# Altium schematic sheet DAC_0.SchDoc
size A2; Date: Date; CompanyName: HESSO; Engineer: Name; Address1: Route du Rawyl 47; Address2: 1950 Sion; Address3: Switzerland; DocumentNumber: 6; SheetNumber: 6; SheetTotal: 6; ProjectName: Project Name
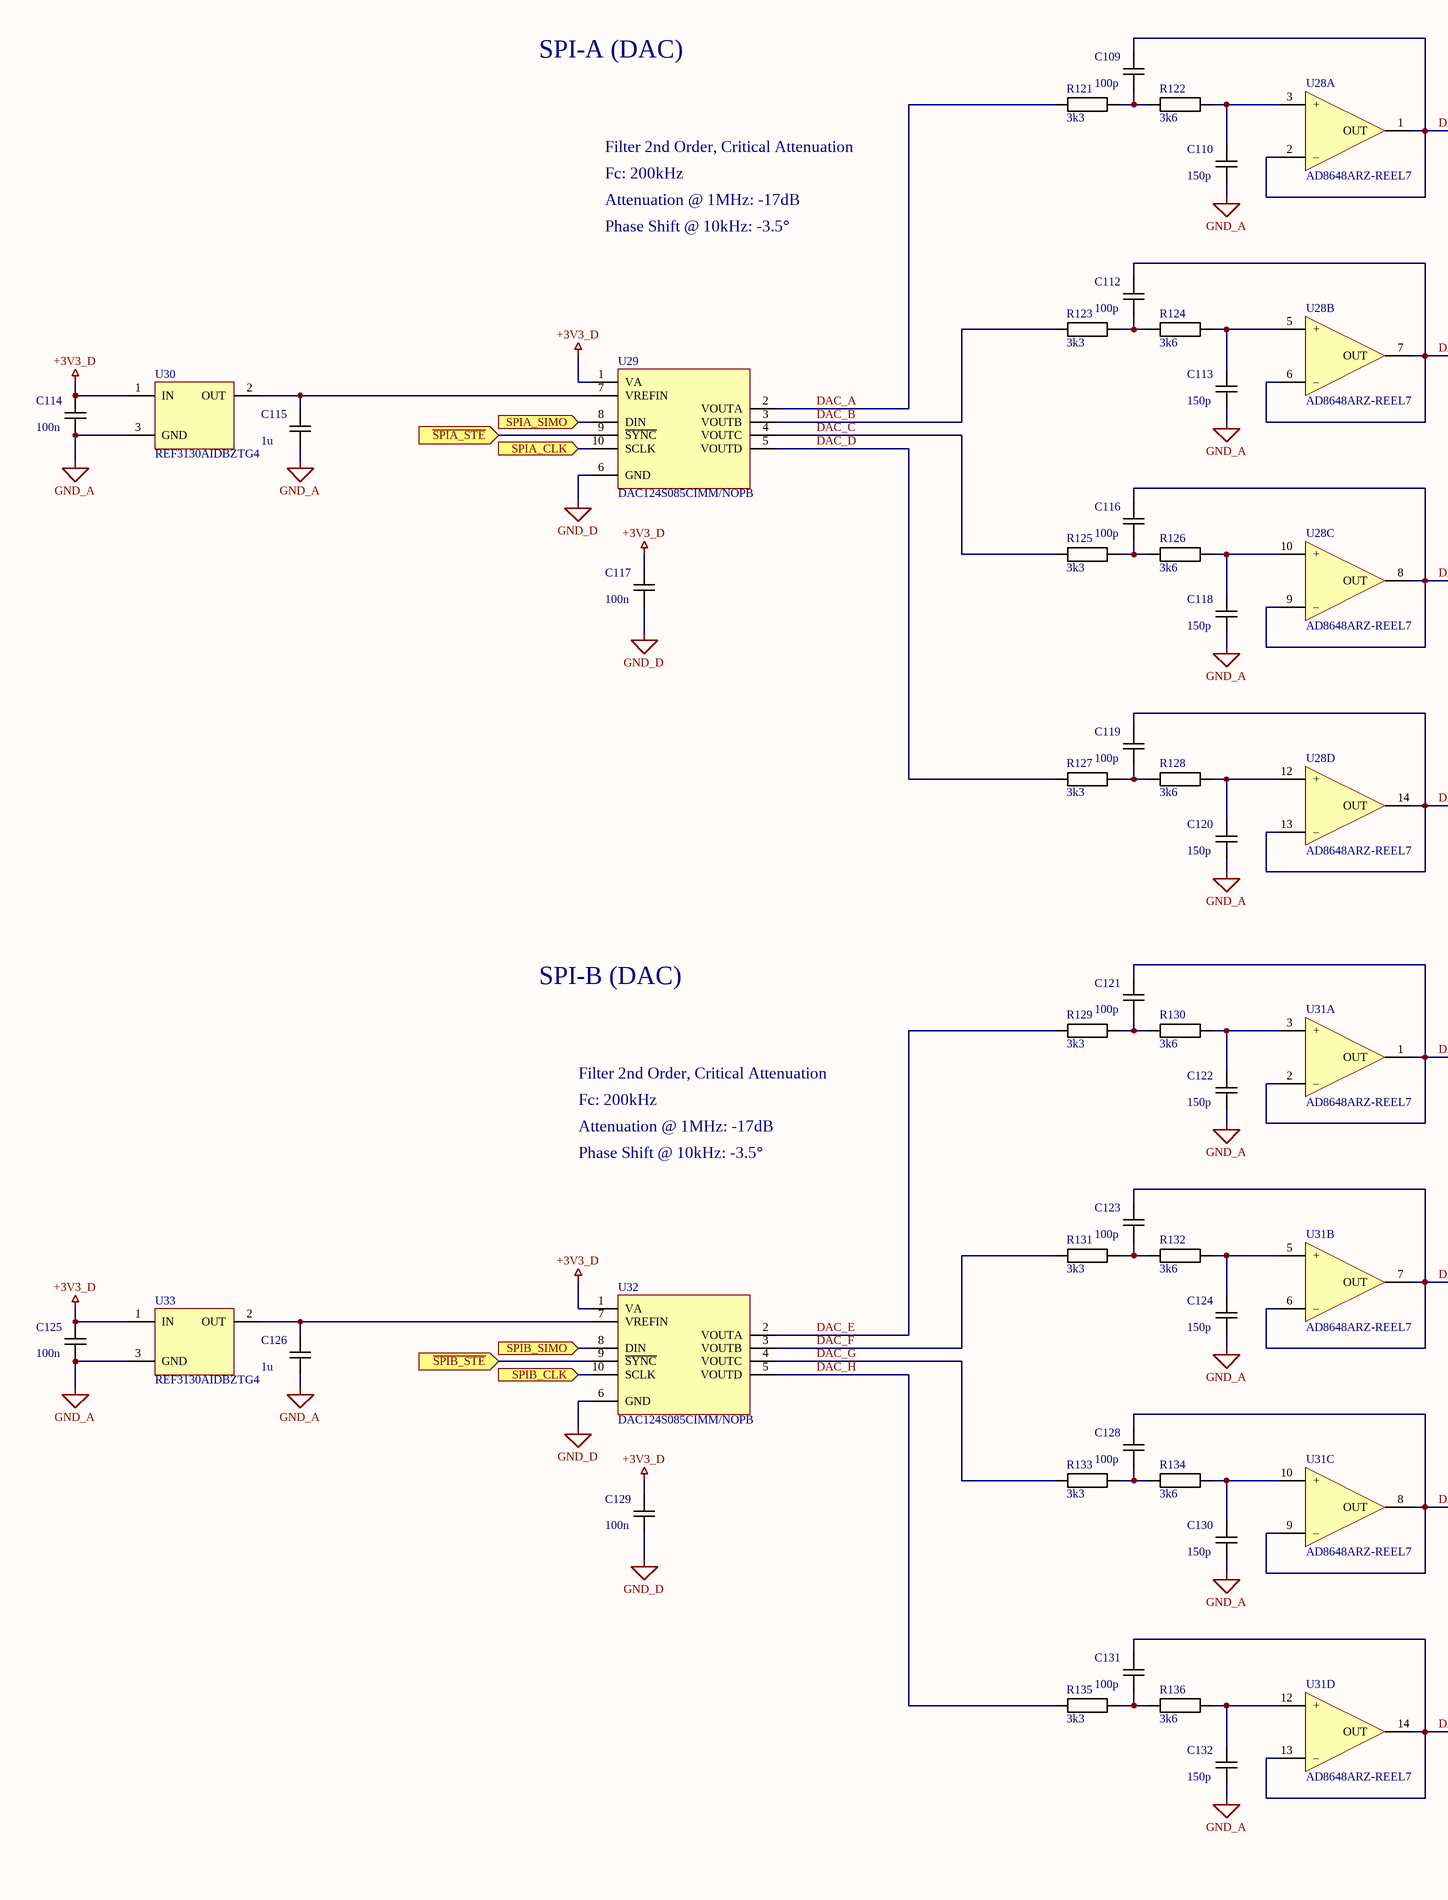
[diagram p0: DAC_0.SchDoc, left]
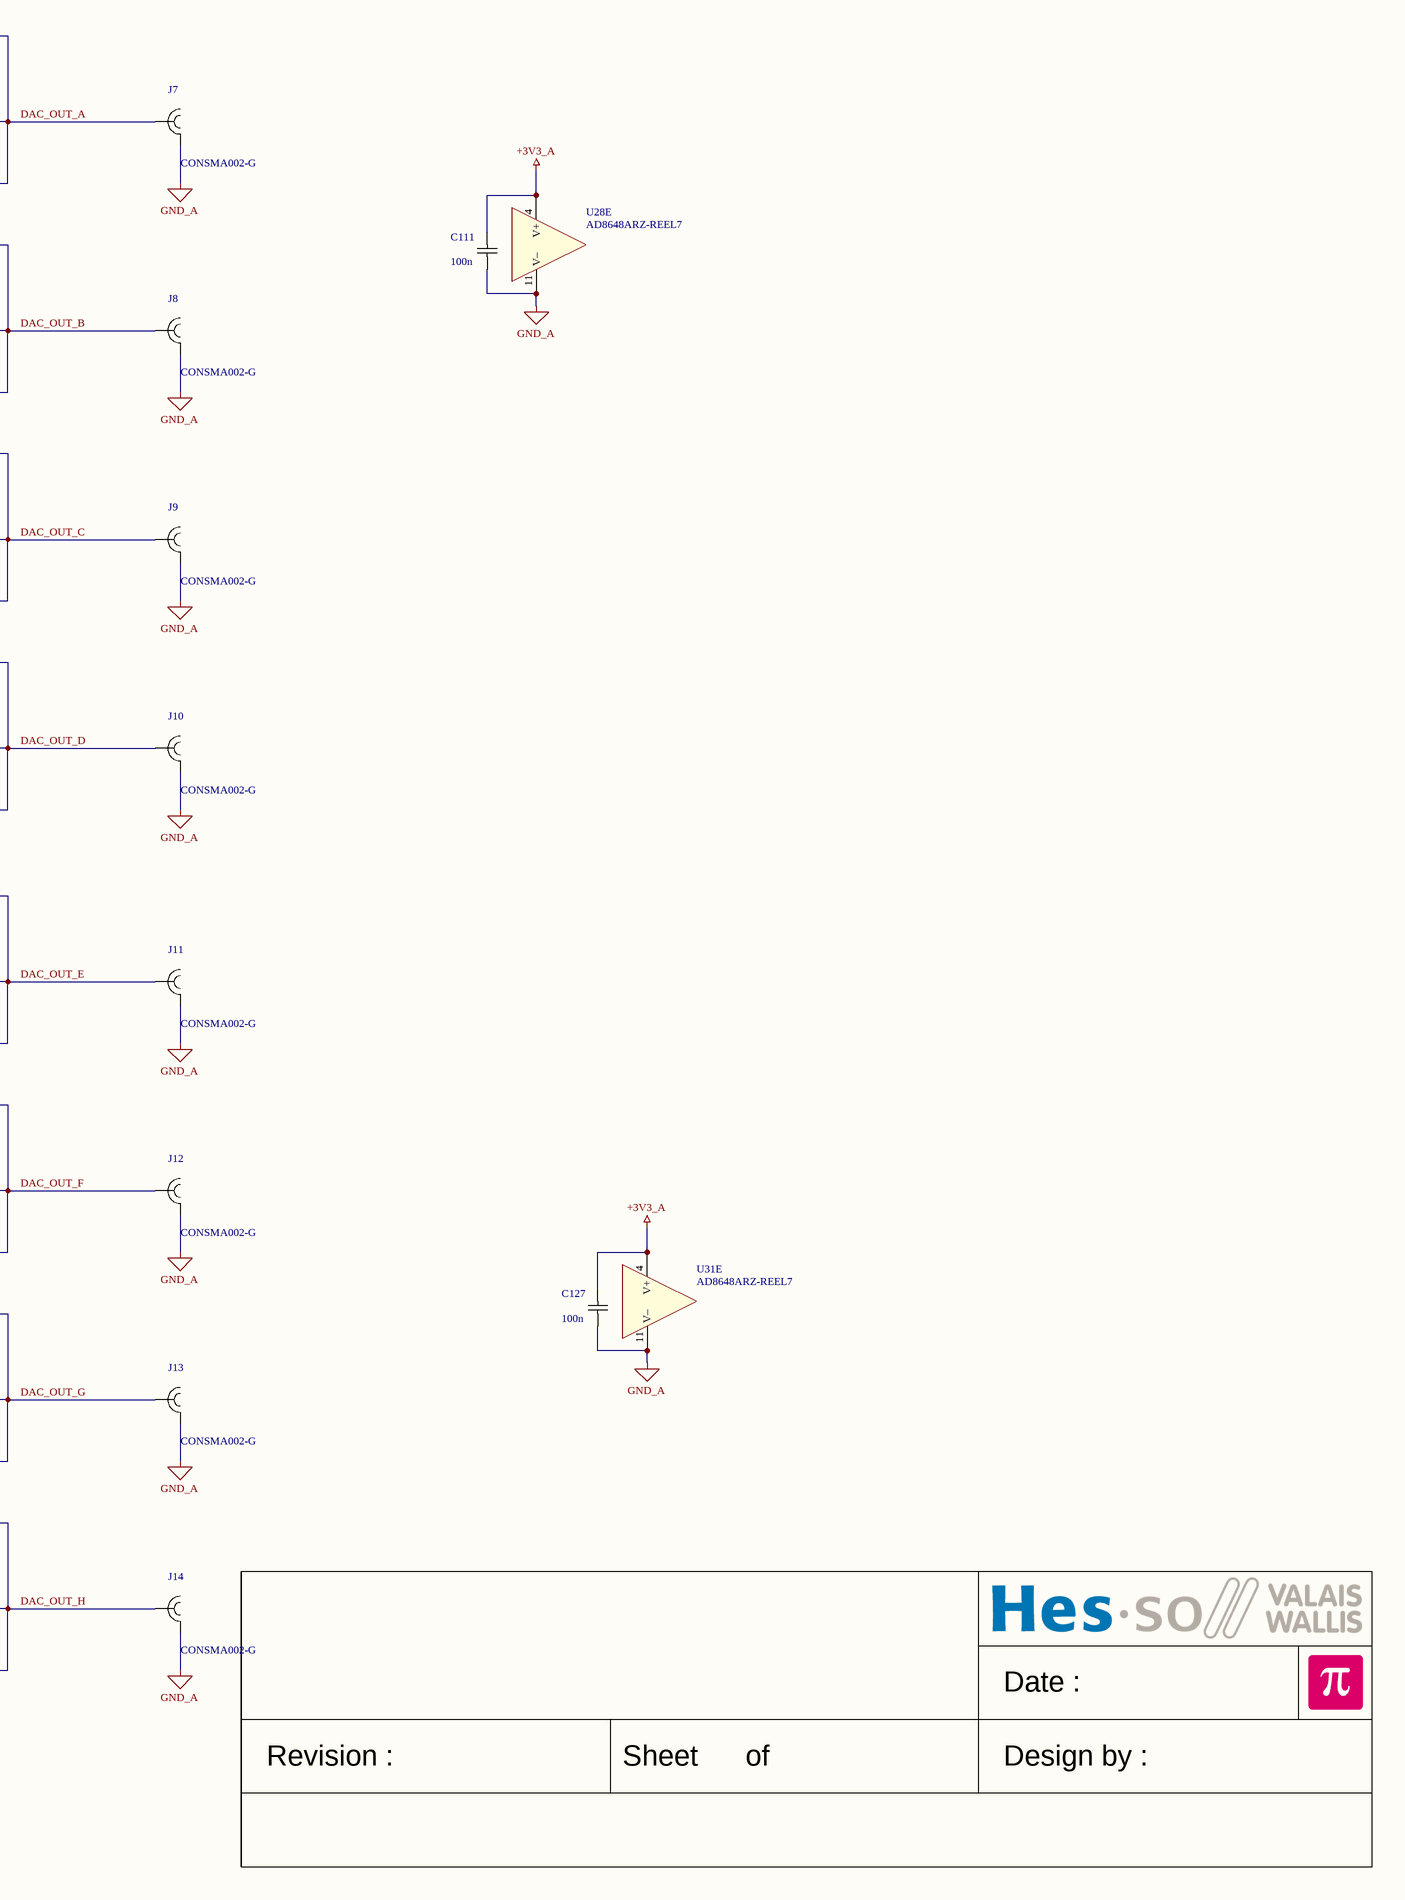
[diagram p1: DAC_0.SchDoc, right]

## Parts
C109  100p  [CAPACITOR 2012 REFLOW]
C110  150p  [CAPACITOR 2012 REFLOW]
C111  100n  [CAPACITOR 1608 REFLOW]
C112  100p  [CAPACITOR 2012 REFLOW]
C113  150p  [CAPACITOR 2012 REFLOW]
C114  100n  [CAPACITOR 2012 REFLOW]
C115  1u  [CAPACITOR 2012 REFLOW]
C116  100p  [CAPACITOR 2012 REFLOW]
C117  100n  [CAPACITOR 1608 REFLOW]
C118  150p  [CAPACITOR 2012 REFLOW]
C119  100p  [CAPACITOR 2012 REFLOW]
C120  150p  [CAPACITOR 2012 REFLOW]
C121  100p  [CAPACITOR 2012 REFLOW]
C122  150p  [CAPACITOR 2012 REFLOW]
C123  100p  [CAPACITOR 2012 REFLOW]
C124  150p  [CAPACITOR 2012 REFLOW]
C125  100n  [CAPACITOR 2012 REFLOW]
C126  1u  [CAPACITOR 2012 REFLOW]
C127  100n  [CAPACITOR 1608 REFLOW]
C128  100p  [CAPACITOR 2012 REFLOW]
C129  100n  [CAPACITOR 1608 REFLOW]
C130  150p  [CAPACITOR 2012 REFLOW]
C131  100p  [CAPACITOR 2012 REFLOW]
C132  150p  [CAPACITOR 2012 REFLOW]
J7  CONSMA002-G  [SMA TH Right Angle Linx CONSMA002]
J8  CONSMA002-G  [SMA TH Right Angle Linx CONSMA002]
J9  CONSMA002-G  [SMA TH Right Angle Linx CONSMA002]
J10  CONSMA002-G  [SMA TH Right Angle Linx CONSMA002]
J11  CONSMA002-G  [SMA TH Right Angle Linx CONSMA002]
J12  CONSMA002-G  [SMA TH Right Angle Linx CONSMA002]
J13  CONSMA002-G  [SMA TH Right Angle Linx CONSMA002]
J14  CONSMA002-G  [SMA TH Right Angle Linx CONSMA002]
R121  3k3  [RESISTOR 2012 REFLOW]
R122  3k6  [RESISTOR 2012 REFLOW]
R123  3k3  [RESISTOR 2012 REFLOW]
R124  3k6  [RESISTOR 2012 REFLOW]
R125  3k3  [RESISTOR 2012 REFLOW]
R126  3k6  [RESISTOR 2012 REFLOW]
R127  3k3  [RESISTOR 2012 REFLOW]
R128  3k6  [RESISTOR 2012 REFLOW]
R129  3k3  [RESISTOR 2012 REFLOW]
R130  3k6  [RESISTOR 2012 REFLOW]
R131  3k3  [RESISTOR 2012 REFLOW]
R132  3k6  [RESISTOR 2012 REFLOW]
R133  3k3  [RESISTOR 2012 REFLOW]
R134  3k6  [RESISTOR 2012 REFLOW]
R135  3k3  [RESISTOR 2012 REFLOW]
R136  3k6  [RESISTOR 2012 REFLOW]
U28  AD8648ARZ-REEL7  [SO14 P1.27 C4.0X8.8 H1.75]  (parts A,B,C,D,E of 5)
U29  DAC124S085CIMM/NOPB  [VSSOP10 P0.5 C3.1X3.1 H1.1]
U30  REF3130AIDBZTG4  [SOT23 P0.95 C1.6x3.0 H1.3]
U31  AD8648ARZ-REEL7  [SO14 P1.27 C4.0X8.8 H1.75]  (parts A,B,C,D,E of 5)
U32  DAC124S085CIMM/NOPB  [VSSOP10 P0.5 C3.1X3.1 H1.1]
U33  REF3130AIDBZTG4  [SOT23 P0.95 C1.6x3.0 H1.3]

## Ports
SPIA_CLK (in), SPIA_SIMO (in), SPIB_CLK (in), SPIB_SIMO (in), ~{SPIA_STE} (in), ~{SPIB_STE} (in)

## Nets
+3V3_A: C111.2 C127.2 U28.4(V+) U31.4(V+)
+3V3_D: C114.2 C117.2 C125.2 C129.2 U29.1(VA) U30.1(IN) U32.1(VA) U33.1(IN)
GND_A: C110.1 C111.1 C113.1 C114.1 C115.1 C118.1 C120.1 C122.1 C124.1 C125.1 C126.1 C127.1 C130.1 C132.1 J7.2 J8.2 J9.2 J10.2 J11.2 J12.2 J13.2 J14.2 U28.11(V–) U30.3(GND) U31.11(V–) U33.3(GND)
GND_D: C117.1 C129.1 U29.6(GND) U32.6(GND)
~{SPIA_STE}: U29.9(~{SYNC}) ; port ~{SPIA_STE}
~{SPIB_STE}: U32.9(~{SYNC}) ; port ~{SPIB_STE}
DAC_A: R121.1 U29.2(VOUTA)
DAC_B: R123.1 U29.3(VOUTB)
DAC_C: R125.1 U29.4(VOUTC)
DAC_D: R127.1 U29.5(VOUTD)
DAC_E: R129.1 U32.2(VOUTA)
DAC_F: R131.1 U32.3(VOUTB)
DAC_G: R133.1 U32.4(VOUTC)
DAC_H: R135.1 U32.5(VOUTD)
DAC_OUT_A: C109.2 J7.1 U28.1(OUT) U28.2(–)
DAC_OUT_B: C112.2 J8.1 U28.6(–) U28.7(OUT)
DAC_OUT_C: C116.2 J9.1 U28.8(OUT) U28.9(–)
DAC_OUT_D: C119.2 J10.1 U28.13(–) U28.14(OUT)
DAC_OUT_E: C121.2 J11.1 U31.1(OUT) U31.2(–)
DAC_OUT_F: C123.2 J12.1 U31.6(–) U31.7(OUT)
DAC_OUT_G: C128.2 J13.1 U31.8(OUT) U31.9(–)
DAC_OUT_H: C131.2 J14.1 U31.13(–) U31.14(OUT)
SPIA_CLK: U29.10(SCLK) ; port SPIA_CLK
SPIA_SIMO: U29.8(DIN) ; port SPIA_SIMO
SPIB_CLK: U32.10(SCLK) ; port SPIB_CLK
SPIB_SIMO: U32.8(DIN) ; port SPIB_SIMO
NetC109_1: C109.1 R121.2 R122.1
NetC110_2: C110.2 R122.2 U28.3(+)
NetC112_1: C112.1 R123.2 R124.1
NetC113_2: C113.2 R124.2 U28.5(+)
NetC115_2: C115.2 U29.7(VREFIN) U30.2(OUT)
NetC116_1: C116.1 R125.2 R126.1
NetC118_2: C118.2 R126.2 U28.10(+)
NetC119_1: C119.1 R127.2 R128.1
NetC120_2: C120.2 R128.2 U28.12(+)
NetC121_1: C121.1 R129.2 R130.1
NetC122_2: C122.2 R130.2 U31.3(+)
NetC123_1: C123.1 R131.2 R132.1
NetC124_2: C124.2 R132.2 U31.5(+)
NetC126_2: C126.2 U32.7(VREFIN) U33.2(OUT)
NetC128_1: C128.1 R133.2 R134.1
NetC130_2: C130.2 R134.2 U31.10(+)
NetC131_1: C131.1 R135.2 R136.1
NetC132_2: C132.2 R136.2 U31.12(+)

## Notes on the sheet
- SPI-A (DAC)
- Filter 2nd Order, Critical Attenuation
- Fc: 200kHz
- Attenuation @ 1MHz: -17dB
- Phase Shift @ 10kHz: -3.5°
- SPI-B (DAC)
- Date :
- Revision :
- Sheet
- of
- Design by :

## Library data of the parts
C109 C110 C112-C114 C116 C118-C125 C128 C130-C132 = Capacitor: Capacitor X7R 10% 50V 2012(0805)
  C109 C112 C116 C119 C121 C123 C128 C131: Value: 100p
  C110 C113 C118 C120 C122 C124 C130 C132: Value: 150p
  C114 C125: Value: 100n
C111 C117 C127 C129 = Capacitor: Capacitor X7R 10% 50V 1608(0603); Value: 100n
C115 C126 = Capacitor: Capacitor X7R 10% 10V 2012(0805); Value: 1u
J7-J14 = SMA TH RIGHT ANGLE LINX CONSMA002: Manufacturer: Linx Technologies; Value: CONSMA002-G; Mouser No.: 712-CONSMA002-G
R121-R136 = Resistor: Resistor 1% 50V 125mW 2012(0805)
  R121 R123 R125 R127 R129 R131 R133 R135: Value: 3k3
  R122 R124 R126 R128 R130 R132 R134 R136: Value: 3k6
U28 U31 = OPA QUAD: Generic quad OPA 14 pins; Manufacturer: Analog Devices; Value: AD8648ARZ-REEL7; Mouser No.: 584-AD8648ARZ-R7
U29 U32 = DAC124S085CIMM: DAC124S085 12-Bit Micro Power Quad Digital-to-Analog Converter With Rail-to-Rail Output; Manufacturer: Texas Instruments; Value: DAC124S085CIMM/NOPB; Mouser No.: 926-DAC124S085CIMMNO
U30 U33 = REFERENCE SOT23 IN,OUT,GND: Generic Positive Voltage Reference; Value: REF3130AIDBZTG4